# Altium project BTL_KTSCT.PrjPcb
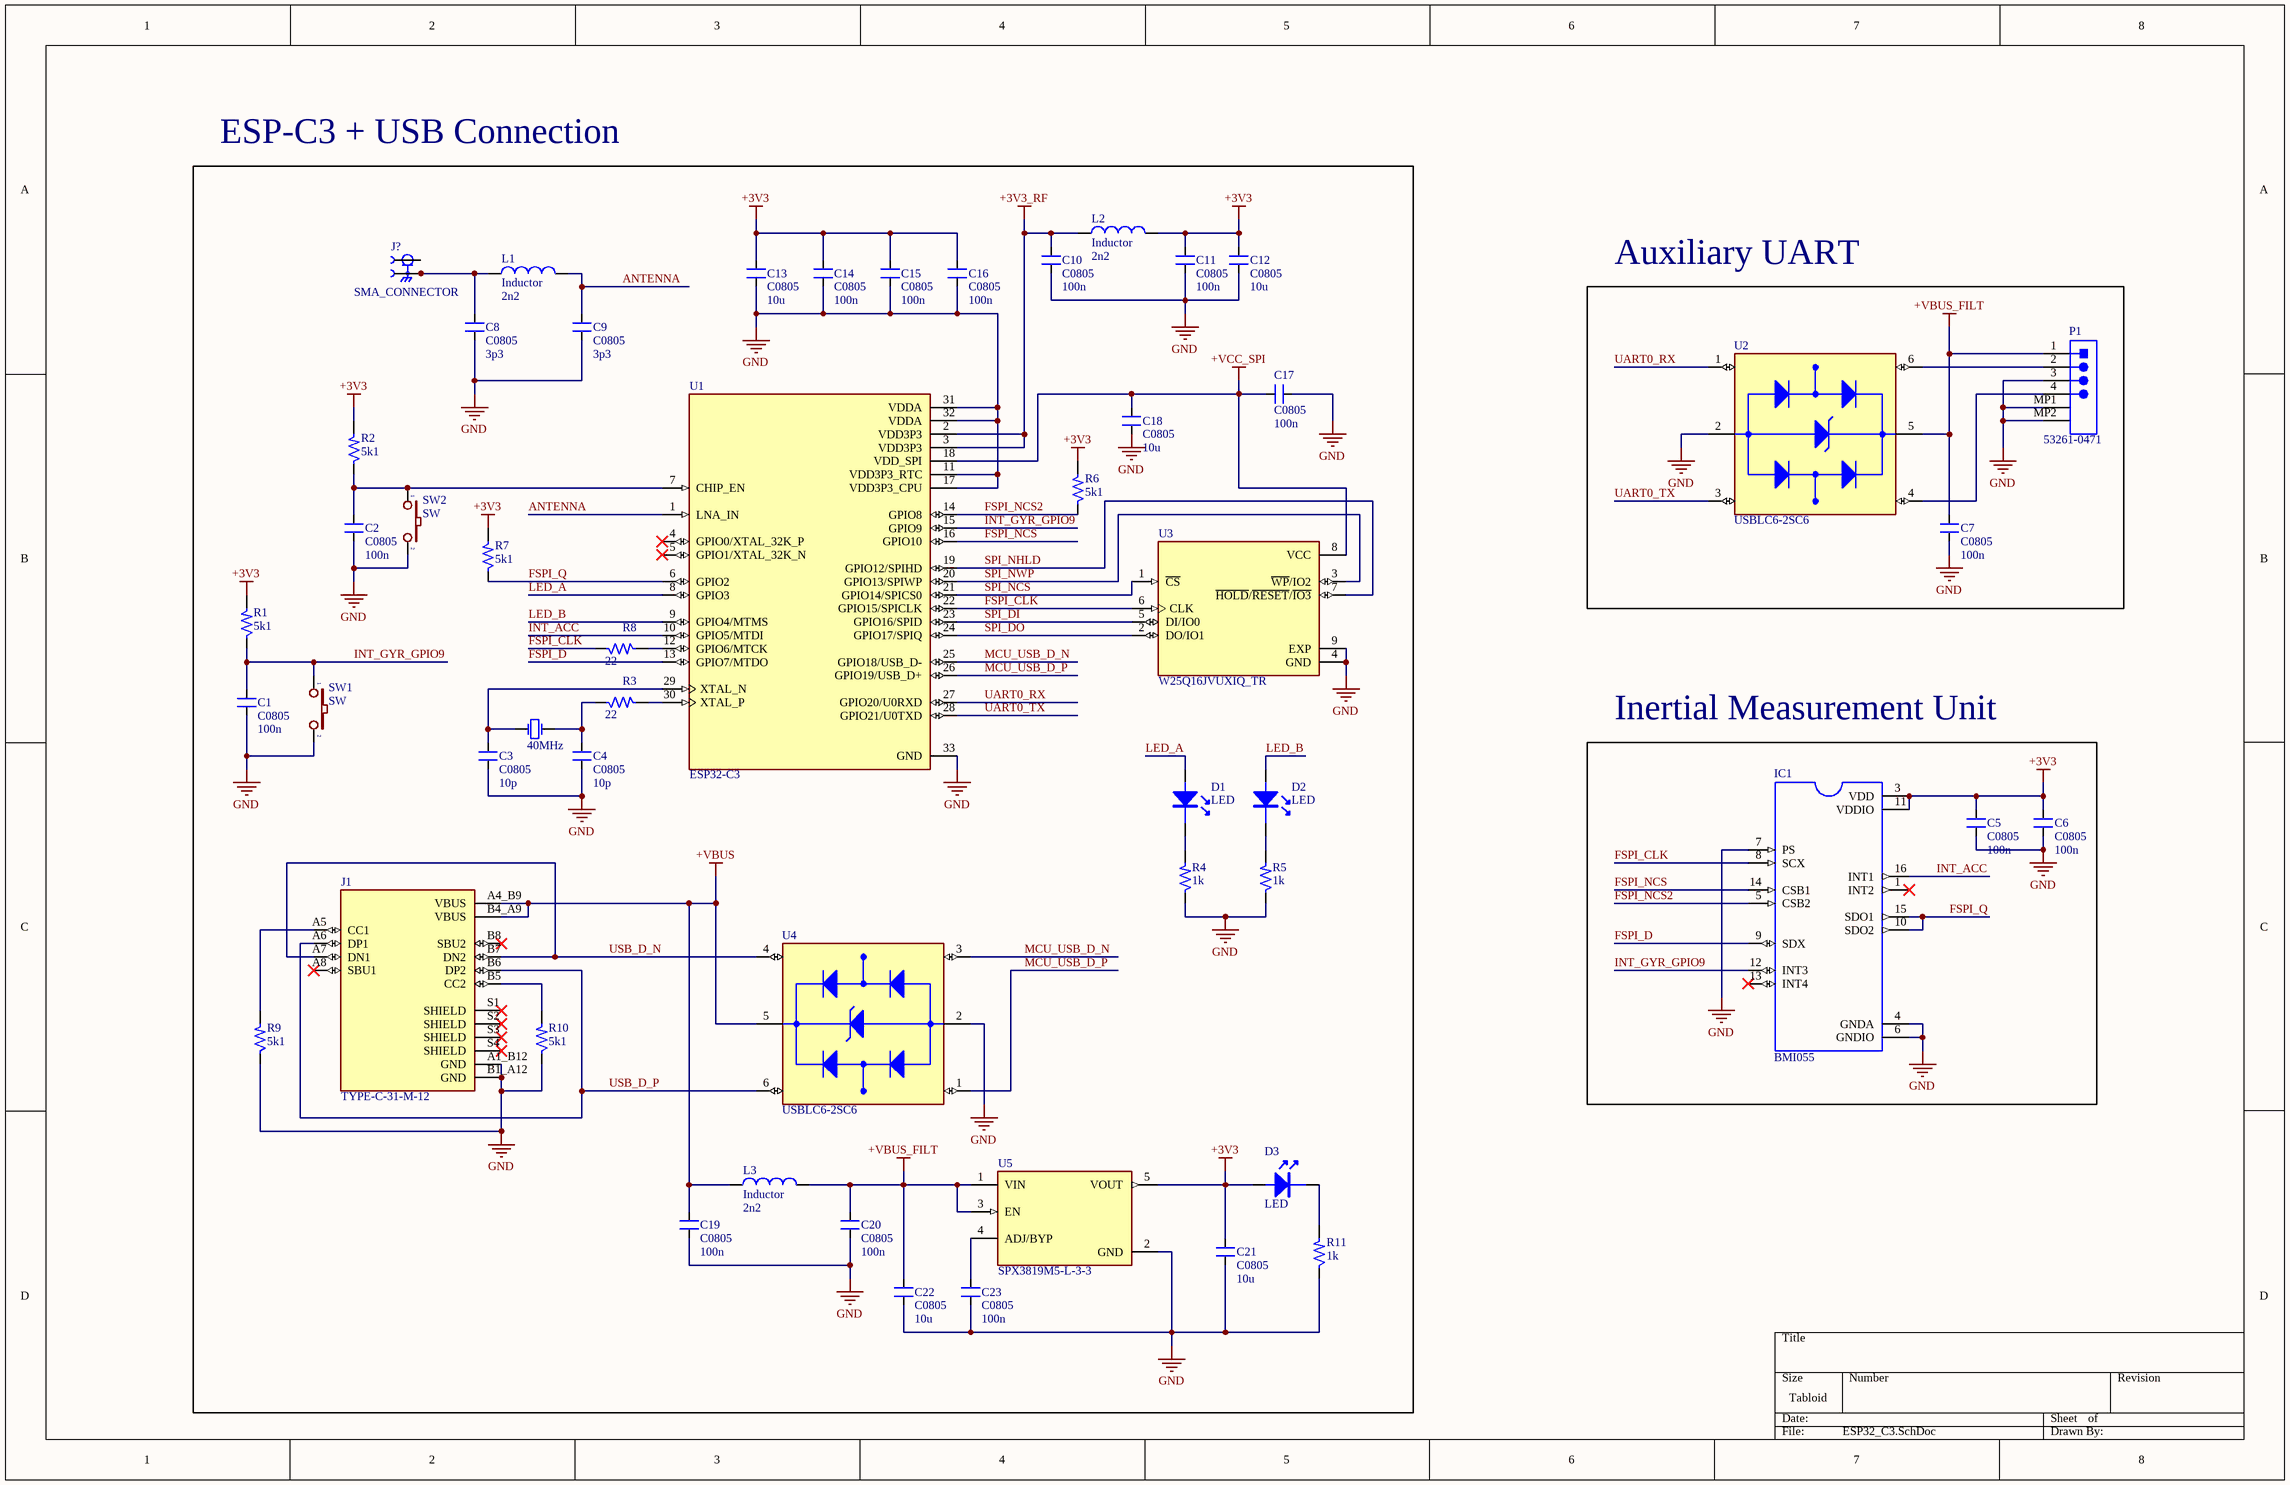
[diagram p0: ESP32_C3.SchDoc]
1 sheet, 52 parts. Net scope: global (net labels, ports and power ports of the same name join across sheets).

## Sheet ESP32_C3.SchDoc
size Tabloid; SheetNumber: 1; SheetTotal: 1

### Parts
C1  C0805  value 100n  [CN-SMD-0805]
C2  C0805  value 100n  [CN-SMD-0805]
C3  C0805  value 10p  [CN-SMD-0805]
C4  C0805  value 10p  [CN-SMD-0805]
C5  C0805  value 100n  [CN-SMD-0805]
C6  C0805  value 100n  [CN-SMD-0805]
C7  C0805  value 100n  [CN-SMD-0805]
C8  C0805  value 3p3  [CN-SMD-0805]
C9  C0805  value 3p3  [CN-SMD-0805]
C10  C0805  value 100n  [CN-SMD-0805]
C11  C0805  value 100n  [CN-SMD-0805]
C12  C0805  value 10u  [CN-SMD-0805]
C13  C0805  value 10u  [CN-SMD-0805]
C14  C0805  value 100n  [CN-SMD-0805]
C15  C0805  value 100n  [CN-SMD-0805]
C16  C0805  value 100n  [CN-SMD-0805]
C17  C0805  value 100n  [CN-SMD-0805]
C18  C0805  value 10u  [CN-SMD-0805]
C19  C0805  value 100n  [CN-SMD-0805]
C20  C0805  value 100n  [CN-SMD-0805]
C21  C0805  value 10u  [CN-SMD-0805]
C22  C0805  value 10u  [CN-SMD-0805]
C23  C0805  value 100n  [CN-SMD-0805]
D1  LED  [CAP10UF]
D2  LED  [CAP10UF]
D3  LED  [CAP10UF]
IC1  BMI055  [QFN50P300X450X100-16N]
J1  TYPE-C-31-M-12  [HRO_TYPE-C-31-M-12]
J?  SMA_CONNECTOR  [LPRS_SMA_CONNECTOR]
L1  Inductor  value 2n2  [L-0805]
L2  Inductor  value 2n2  [L-0805]
L3  Inductor  value 2n2  [L-0805]
P1  53261-0471  [MOLEX-53261-0471_V]
R1  5k1  [SM-1206]
R2  5k1  [SM-1206]
R3  22  [SM-1206]
R4  1k  [SM-1206]
R5  1k  [SM-1206]
R6  5k1  [SM-1206]
R7  5k1  [SM-1206]
R8  22  [SM-1206]
R9  5k1  [SM-1206]
R10  5k1  [SM-1206]
R11  1k  [SM-1206]
SW1  SW  [SW2]
SW2  SW  [SW2]
U1  ESP32-C3  [QFN50P500X500X90-33N]
U2  USBLC6-2SC6  [SOT95P280X145-6N]
U3  W25Q16JVUXIQ_TR  [IC_W25Q16JVUXIQ_TR]
U4  USBLC6-2SC6  [SOT95P280X145-6N]
U5  SPX3819M5-L-3-3  [SOT95P280X145-5N]
Y1  40MHz  [XTAL]

### Blocks framed on the sheet
ESP-C3 + USB Connection: C1-C4 C8-C23 D1-D3 J1 J? L1-L3 R1-R11 SW1 SW2 U1 U3-U5 Y1
Auxiliary UART: C7 P1 U2
Inertial Measurement Unit: C5 C6 IC1

### Nets
+3V3: C5.1 C6.1 C11.2 C12.2 C13.2 C14.2 C15.2 C16.2 C21.2 D3.1 IC1.3(VDD) IC1.11(VDDIO) L2.2 R1.2 R2.2 R6.2 R7.2 U5.5(VOUT)
+3V3_RF: C10.2 L2.1 U1.2(VDD3P3) U1.3(VDD3P3)
+VBUS: C19.2 J1.A4_B9(VBUS) J1.B4_A9(VBUS) L3.1 U4.5(VBUS)
+VBUS_FILT: C7.1 C20.2 C22.2 L3.2 P1.1 U2.5(VBUS) U5.1(VIN) U5.3(EN)
+VCC_SPI: C17.2 C18.2 U1.18(VDD_SPI) U3.8(VCC)
GND: C1.1 C2.1 C3.1 C4.1 C5.2 C6.2 C7.2 C8.1 C9.1 C10.1 C11.1 C12.1 C13.1 C14.1 C15.1 C16.1 C17.1 C18.1 C19.1 C20.1 C21.1 C22.1 C23.1 IC1.4(GNDA) IC1.6(GNDIO) IC1.7(PS) J1.A1_B12(GND) J1.B1_A12(GND) P1.3 P1.MP1 P1.MP2 R4.1 R5.1 R9.1 R10.1 R11.1 SW1.2 SW2.2 U1.11(VDD3P3_RTC) U1.17(VDD3P3_CPU) U1.31(VDDA) U1.32(VDDA) U1.33(GND) U2.2(GND) U3.4(GND) U3.9(EXP) U4.2(GND) U5.2(GND)
ANTENNA: C9.2 L1.2 U1.1(LNA_IN)
FSPI_CLK: IC1.8(SCX) R8.1 U1.22(GPIO15/SPICLK) U3.6(CLK)
FSPI_D: IC1.9(SDX) U1.13(GPIO7/MTDO)
FSPI_NCS: IC1.14(CSB1) U1.16(GPIO10)
FSPI_NCS2: IC1.5(CSB2) R6.1 U1.14(GPIO8)
FSPI_Q: IC1.10(SDO2) IC1.15(SDO1) R7.1 U1.6(GPIO2)
INT_ACC: IC1.16(INT1) U1.10(GPIO5/MTDI)
INT_GYR_GPIO9: C1.2 IC1.12(INT3) R1.1 SW1.1 U1.15(GPIO9)
LED_A: D1.1 U1.8(GPIO3)
LED_B: D2.1 U1.9(GPIO4/MTMS)
MCU_USB_D_N: U1.25(GPIO18/USB_D-) U4.3(I/O2_IN)
MCU_USB_D_P: U1.26(GPIO19/USB_D+) U4.1(I/O1_IN)
SPI_DI: U1.23(GPIO16/SPID) U3.5(DI/IO0)
SPI_DO: U1.24(GPIO17/SPIQ) U3.2(DO/IO1)
SPI_NCS: U1.21(GPIO14/SPICS0) U3.1(~{CS})
SPI_NHLD: U1.19(GPIO12/SPIHD) U3.7(~{HOLD}/~{RESET}/~{IO3})
SPI_NWP: U1.20(GPIO13/SPIWP) U3.3(~{WP}/IO2)
UART0_RX: U1.27(GPIO20/U0RXD) U2.1(I/O1_IN)
UART0_TX: U1.28(GPIO21/U0TXD) U2.3(I/O2_IN)
USB_D_N: J1.A7(DN1) J1.B7(DN2) U4.4(I/O2_OUT)
USB_D_P: J1.A6(DP1) J1.B6(DP2) U4.6(I/O1_OUT)
NetC2_2: C2.2 R2.1 SW2.1 U1.7(CHIP_EN)
NetC3_2: C3.2 U1.29(XTAL_N) Y1.1(OSC1)
NetC4_2: C4.2 R3.1 Y1.2(OSC2)
NetC8_2: C8.2 J?.G1 J?.G2 J?.G3 J?.G4 L1.1
NetC23_2: C23.2 U5.4(ADJ/BYP)
NetD1_2: D1.2 R4.2
NetD2_2: D2.2 R5.2
NetD3_2: D3.2 R11.2
NetJ1_A5: J1.A5(CC1) R9.2
NetJ1_B5: J1.B5(CC2) R10.2
NetP1_2: P1.2 U2.6(I/O1_OUT)
NetP1_4: P1.4 U2.4(I/O2_OUT)
NetR3_2: R3.2 U1.30(XTAL_P)
NetR8_2: R8.2 U1.12(GPIO6/MTCK)

Not connected (* = marked no-connect by the designer): IC1 1(INT2)* 13(INT4)*; J1 A8(SBU1)* B8(SBU2)* S1(SHIELD)* S2(SHIELD)* S3(SHIELD)* S4(SHIELD)*; J? 1; U1 4(GPIO0/XTAL_32K_P)* 5(GPIO1/XTAL_32K_N)*

### Library data of the parts
C1-C23 = CAP-SMD-0805: Cap SMD
IC1 = BMI055: BMI055 series Accelerometer, Gyroscope, 6 Axis Sensor Evaluation Board; MF: Bosch; SnapEDA_Link: https://www.snapeda.com/parts/BMI055/Bosch/view-part/?ref=snap; Package: LGA-16 Bosch; Value: *; MP: BMI055; Check_prices: https://www.snapeda.com/parts/BMI055/Bosch/view-part/?ref=eda
J1 = TYPE-C-31-M-12: USB Connectors 24 Receptacle 1 8.94*7.3mm RoHS; MF: HRO Electronics Co., Ltd.; SnapEDA_Link: https://www.snapeda.com/parts/TYPE-C-31-M-12/HRO+Electronics+Co.%252C+Ltd./view-part/?ref=snap; Package: Package; Value: *; MP: TYPE-C-31-M-12; Check_prices: https://www.snapeda.com/parts/TYPE-C-31-M-12/HRO+Electronics+Co.%252C+Ltd./view-part/?ref=eda
J? = SMA_CONNECTOR: Straight SMA Connector; MP: altium_native_batch; Value: *; Package: None; Availability: Unavailable; Price: None
L1-L3 = Inductor: Code_IEC: 1005; Published: 8-Jun-2000; LatestRevisionDate: 17-Jul-2002; LatestRevisionNote: Re-released for DXP Platform.; PackageReference: 0402-A; Publisher: Altium Limited; Code_JEITA: 0402
P1 = CMP-2000-05238-1: Male Header, Pitch 1.25 mm, 1 x 4 Position, Height 3.4 mm, -40 to 85 degC, RoHS, Tape and Reel; Current Rating: 1A; Brand: Molex; Number of Positions / Contacts: 4; Pitch: 1.25mm; Voltage Rating: 125V; Mounting Angle: Right; Manufacturer URL: http://www.molex.com/; Factory Pack Quantity: 1000; Housing Material: Thermoplastic; Datasheet URL: http://www.molex.com/pdm_docs/sd/532610471_sd.pdf; Tradename: PicoBlade; Product Type: Headers; Contact Plating: Tin; Contact Material: PhosphorBronze; Package Description: 1.25mm Pitch PicoBlade(TM) Header, Surface Mount, Right Angle, Lead-Free, 4 Circuits; Mounting Style: SMD/SMT; Manufacturer: Molex; Series: 53261; Packaging: Reel; Number of Rows: 1; RoHS: Details; Number of Positions: 4; Product Category: Headers&WireHousings; Datasheet Version: Rev. G, 01/2012; Type: Shrouded; Termination Style: SMD
R1-R11 = R: Resistor 1/4W; Value: R1/4W - 1K
SW1 SW2 = SW2: Switch button 2 pin; Value: SW chip 2 pin
U1 = ESP32-C3: WiFi Modules (802.11) (Engineering Samples Only) SMD IC ESP32-C3, RISC-V single-core MCU, 2.4G Wi-Fi & BLE 5.0 combo, QFN 32-pin, 5*5 mm, 40 ~ 105C; MF: Espressif Systems; SnapEDA_Link: https://www.snapeda.com/parts/ESP32-C3/Espressif+Systems/view-part/?ref=snap; Package: VFQFN-32 Espressif Systems; Value: *; MP: ESP32-C3; Check_prices: https://www.snapeda.com/parts/ESP32-C3/Espressif+Systems/view-part/?ref=eda
U2 U4 = USBLC6-2SC6: 17V Clamp 5A (8/20Âµs) Ipp Tvs Diode Surface Mount SOT-23-6; MF: STMicroelectronics; Value: *; SnapEDA_Link: https://www.snapeda.com/parts/USBLC6-2SC6/STMicroelectronics/view-part/?ref=snap; Check_prices: https://www.snapeda.com/parts/USBLC6-2SC6/STMicroelectronics/view-part/?ref=eda; Purchase-URL: https://pricing.snapeda.com/search/part/USBLC6-2SC6/?ref=eda; Price: None; Availability: In Stock; Package: SOT-23-6 STMicroelectronics; MP: USBLC6-2SC6
U3 = W25Q16JVUXIQ_TR: NOR Flash Serial (SPI, Dual SPI, Quad SPI) 3V/3.3V 16M-bit 2M x 8 6ns 8-Pin USON EP T/R; MF: Winbond; MP: W25Q16JVUXIQ TR; Purchase-URL: https://pricing.snapeda.com/search/part/W25Q16JVUXIQ TR/?ref=eda; Value: *; SnapEDA_Link: https://www.snapeda.com/parts/W25Q16JVUXIQ%20TR/Winbond/view-part/?ref=snap; Package: UFDFN-8 Winbond; Check_prices: https://www.snapeda.com/parts/W25Q16JVUXIQ%20TR/Winbond/view-part/?ref=eda; Price: None; Availability: In Stock
U5 = SPX3819M5-L-3-3: Linear Voltage Regulator IC Positive Fixed 1 Output 500mA SOT-23-5; MF: MaxLinear, Inc.; MP: SPX3819M5-L-3-3/TR; SnapEDA_Link: https://www.snapeda.com/parts/SPX3819M5-L-3-3/TR/MaxLinear%252C+Inc./view-part/?ref=snap; Package: SOT-23-5 Exar; Value: *; Check_prices: https://www.snapeda.com/parts/SPX3819M5-L-3-3/TR/MaxLinear%252C+Inc./view-part/?ref=eda
Y1 = XTAL: Crystal Oscillator; Published: 8-Jun-2000; LatestRevisionDate: 17-Jul-2002; LatestRevisionNote: Re-released for DXP Platform.; PackageReference: R38; Publisher: Altium Limited